# Altium schematic sheet FuenteDeAlimentacion_SCH.SchDoc: Fuente de Alimentación
size A4; Author: **; CompanyName: Electrónica Aplicada al Automotor; Organization: UTN FRBA; DocumentNumber: 2; Revision: 01; SheetNumber: 2; SheetTotal: 7; Autor: Badenas, Francisco J. / Ipar, Eugenia
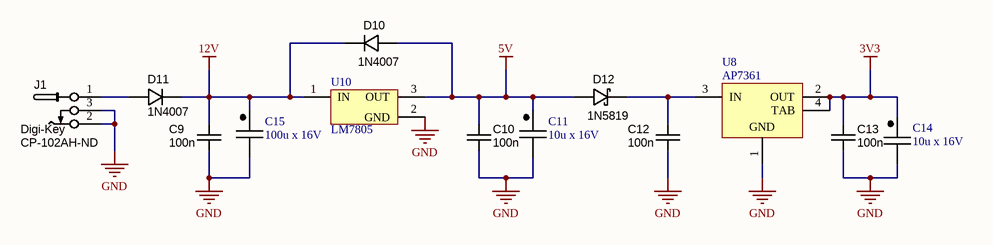
[diagram p0: FuenteDeAlimentacion_SCH.SchDoc]

## Parts
C9  100n  [CAPC1608X90N]
C10  100n  [CAPC1608X90N]
C11  10u x 16V  [CAP_Elec_5x5.7]
C12  100n  [CAPC1608X90N]
C13  100n  [CAPC1608X90N]
C14  10u x 16V  [CAP_Elec_5x5.7]
C15  100u x 16V  [CAP_ELEC_6.3X4.2]
D10  1N4007  [DO-214AC]
D11  1N4007  [DO-214AC]
D12  1N5819  [SOD123]
J1  Supplier 1: Digi-Key  Supplier Part Number 1: CP-102AH-ND  [CONN_PWR_JACK_2.1x5.5mm]  (hidden comment: CONN_PWR_JACK_2.1x5.5mm)
U8  AP7361  [MP04A_L]
U10  LM7805  [TO-220 FLAT]

## Nets
3V3: C13.1 C14.1 U8.2(OUT) U8.4(TAB)
5V: C10.1 C11.1 D10.A D12.A U10.3(OUT)
12V: C9.1 C15.1 D10.K D11.K U10.1(IN)
GND: C9.2 C10.2 C11.2 C12.2 C13.2 C14.2 C15.2 J1.2 J1.3 U8.1(GND) U10.2(GND)
NetC12_1: C12.1 D12.K U8.3(IN)
NetD11_A: D11.A J1.1

## Notes on the sheet
- Title:
- Size:
- Author:
- A4
- Sheet
- of
- Revision:
- File:
- Date:

## Library data of the parts
C9 C10 C12 C13 = CAPC_47n_0603_X7R_50V_10%: Capacitor SMD Cer 100nF 10% 50V X7R 0603; Manufacturer 1: AVX Corporation; Manufacturer Part Number 1: 06035C473KAT2A; Ratings: 50V; X7R; Material: ceramic; SCDType: spec; Manufacturer 3: Samsung; Manufacturer Part Number 3: CL10B473KBN; Package / Case: 0603 (1608 metric); Tolerance: ±10%; Supplier 1: Digi-Key; Supplier Part Number 1: 478-5146-1-ND; Manufacturer Part Number 2: C1608X7R1H473K080AA; Manufacturer 2: TDK Corporation; ComponentLink1URL: http://www.avx.com/docs/Catalogs/cx7r.pdf; ComponentLink1Description: http://www.avx.com/docs/Catalogs/cx7r.pdf; Supplier 2: Digi-Key; Supplier Part Number 2: 445-1313-1-ND; ComponentLink2URL: http://product.tdk.com/capacitor/mlcc/en/documents/mlcc_commercial_general_en.pdf; ComponentLink2Description: http://product.tdk.com/capacitor/mlcc/en/documents/mlcc_commercial_general_en.pdf; Value: 100n
C11 C14 = CAP_Elec_4x4
C15 = CAP_Elec_6.2x6.2
D10 D11 = DIODE_100V_1.5A_SMA: Diode 1N4007 SMD DO-214AC 100V 1.5A SMA; Manufacturer 1: Diodes Inc; Ratings: 100V; 1.5A; Material: Si; Diode Type: Standard; Value: Vf = 1.15V @ 1.5A (Max); SCDType: source; Package / Case: DO-214AC, SMA; Supplier 1: Digi-Key; Supplier Part Number 1: S2BA-FDICT-ND; Manufacturer Part Number 1: 1N4007
D12 = DIODE_SCHOTTKY_40V_1A: Diode Schottky SMD 40V 1A SOD123; Manufacturer 1: Diodes Inc; Ratings: 40V; 1A; Material: Si; SCDType: spec; Package / Case: SOD123; Diode Type: Schottky; Mounting Type: Surface Mount; Supplier 1: Digi-Key; Supplier Part Number 1: 1N5819HW-FDICT-ND; Manufacturer Part Number 1: 1N5819
J1 = CONN_PWR_JACK_2.1x5.5mm: Power Connector, THT, 2.1mm ID, 5.5mm OD; Manufacturer 1: CUI Inc; Manufacturer Part Number 1: PJ-102AH; SCDType: undef; Category: Connectors; Mounting Type: Through Hole; Package / Case: PCB mount; Value: 2.1mm ID, 5.5mm OD
U8 = CMP-0062-01652-3: 800mA Low-Dropout Linear Regulator, 4-pin SOT-223; Manufacturer: National Semiconductor; PartNumber: LM1117MPX-1.8; PackageTopMarking: XYTT*N12A; PowerWise: N; High-Reliability: Y; CompType: LDO IC; ComponentLink3URL: http://www.national.com/pf/LM/LM1117.html; RoHS: N; Code_JEDEC: TO-261-AA; ComponentLink1URL: http://www.national.com/; PinCount: 4; DatasheetVersion: Apr-2006; PackageReference: MP04A; RevisionNote: SCH symbol layout adjusted; ComponentLink2Description: LM1117 Datasheet; PackageDescription: Molded SOT-223, 6.50 x 3.56 x 1.6mm Body, 4 Lead, 2.3mm Pitch; ComponentLink2URL: http://www.national.com/ds/LM/LM1117.pdf; ComponentLink3Description: LM1117 Web Page; Code_IPC: SOT223-4; ComponentLink1Description: Manufacturer URL; ComponentLink4URL: http://www.national.com/packaging/folders/mp04a.html; PackageVersion: revB, Apr-2003; ComponentLink4Description: MP04A Package Page
U10 = LM7805: Regulador LM7805 Flat TO-220